# EAGLE design mini-usb-ftdi-breakout (EAGLE 7.2.0)
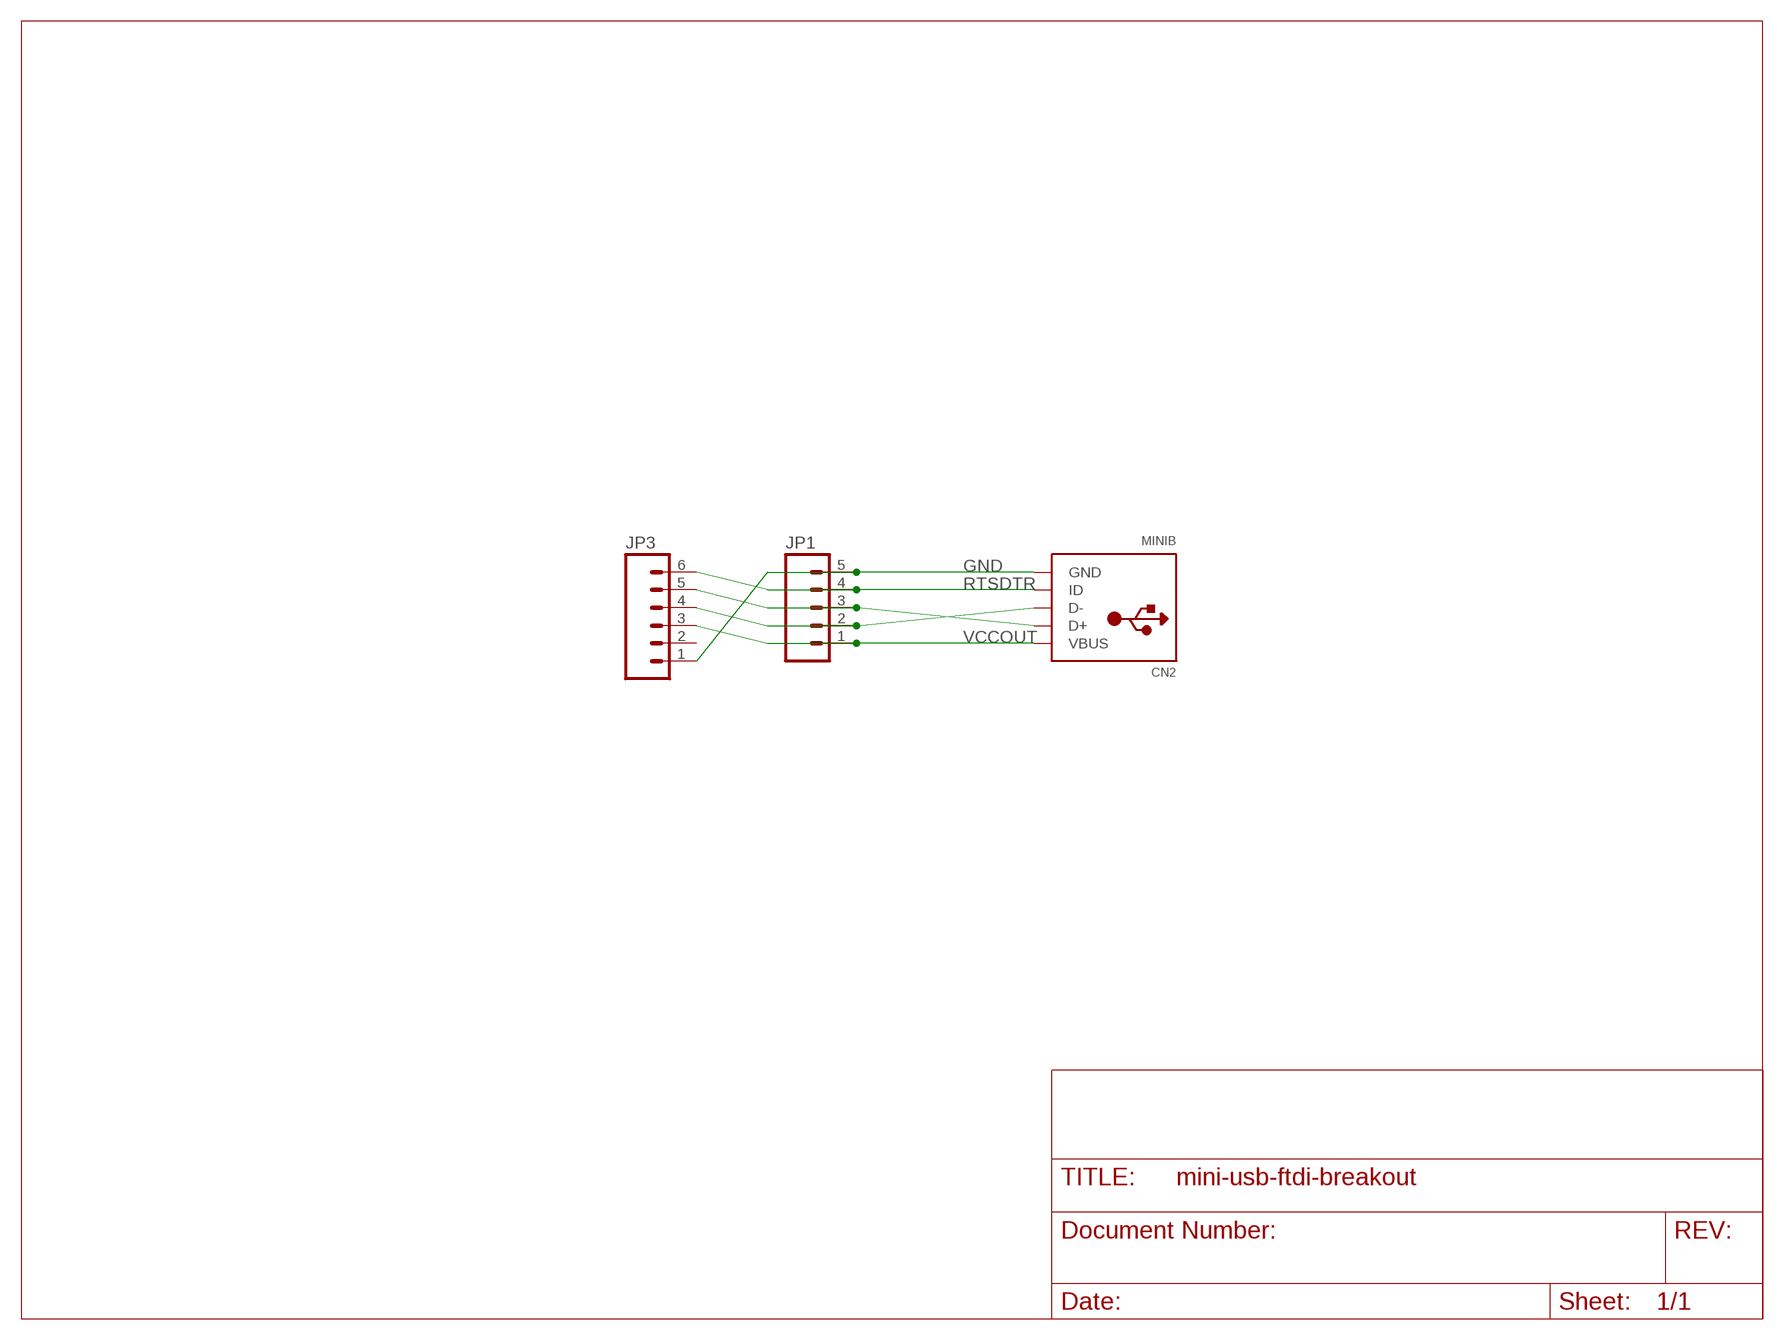
[diagram p0: schematic, sheet 1]

## Parts
CN2  MINIB  USBMINIB  [USB-MINIB]
JP1  M05PTH  [1X05]
JP3  M06SMD  [1X06-SMD]

## Nets
GND: CN2.GND JP1.5 JP3.1
N$2: CN2.D+ JP1.3 JP3.5
N$3: CN2.D- JP1.2 JP3.4
RTSDTR: CN2.ID JP1.4 JP3.6
VCCOUT: CN2.VBUS JP1.1 JP3.3
Unconnected: JP3.2

## Library data of the parts
CN2 = adafruit:USB: USB Connectors USBMINIB - Surface Mount Female Mini-B USB Connector 4UConnector: 06564 By microbuilder.eu Thru-hole RA Female Mini-B USB Connector 4UConnector: 18732 By ladyada.net
JP1 = SparkFun-Connectors:M05: Header 5 Standard 5-pin 0.1" header. Use with straight break away headers (SKU : PRT-00116), right angle break away headers (PRT-00553), swiss pins (PRT-00743), machine pins (PRT-00117), and female headers (PRT-00115). Molex polarized connector foot print use with SKU : PRT-08230 with associated crimp pins and housings.
JP3 = SparkFun-Connectors:M06: Header 6 Standard 6-pin 0.1" header. Use with straight break away headers (SKU : PRT-00116), right angle break away headers (PRT-00553), swiss pins (PRT-00743), machine pins (PRT-00117), and female headers (PRT-00115). Molex polarized connector foot print use with SKU : PRT-08094 with associated crimp pins and housings. NOTES ON THE VARIANTS LOCK and LOCK_LONGPADS... This footprint was designed to help hold the alignment of a through-hole component (i.e. 6-pin header) while soldering it into place. You may notice that each hole has been shifted either up or down by 0.005 of an inch from it's more standard position (which is a perfectly straight line). This slight alteration caused the pins (the squares in the middle) to touch the edges of the holes. Because they are alternating, it causes a "brace" to hold the component in place. 0.005 has proven to be the perfect amount of "off-center" position when using our standard breakaway headers. Although looks a little odd when you look at the bare footprint, once you have a header in there, the alteration is very hard to notice. Also,if you push a header all the way into place, it is covered up entirely on the bottom side. This idea of altering the position of holes to aid alignment will be further integrated into the Sparkfun Library for other footprints. It can help hold any component with 3 or more connection pins.

## Board
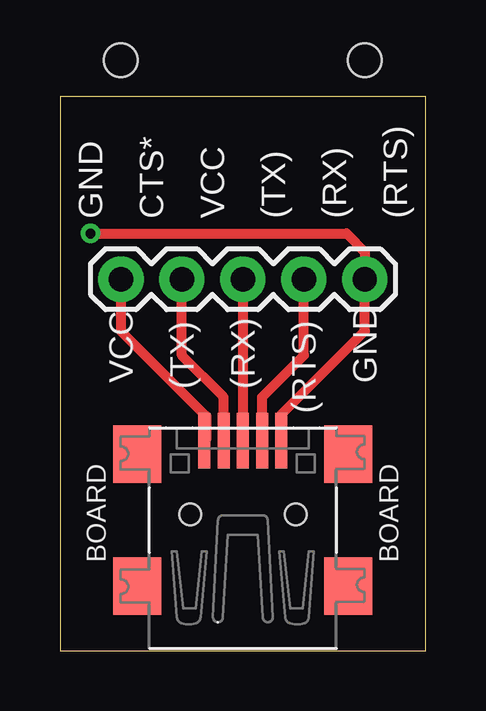
[diagram p1: board, top side]
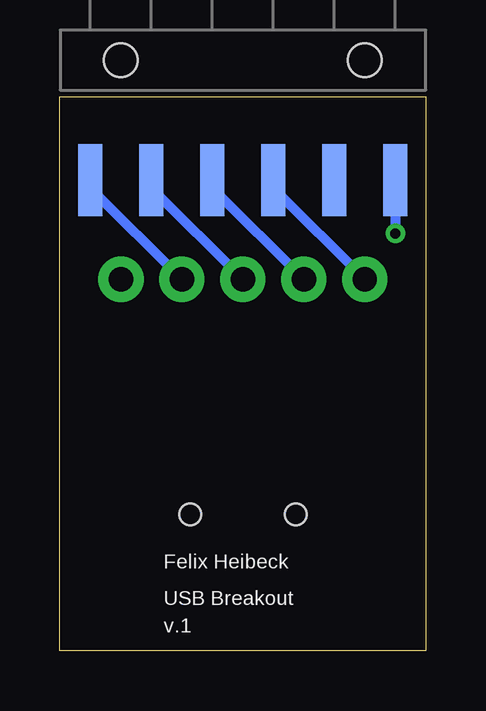
[diagram p2: board, bottom side, seen from below]

Size 15.24 x 23.11 mm. Coordinates in mm from the lower left corner, seen from the top.
Outline: 0,23.11 0,0 15.24,0 15.24,23.11 0,23.11
Copper layers (1*16): Top 0.035mm / dielectric 1.5mm / Bottom 0.035mm
Design rules "default *": minimum track width 10mil, minimum drill 19mil, track to track 8mil, track to pad 8mil, pad to pad 8mil, via to via 8mil, smd to smd 8mil, copper to edge 20mil, drill to drill 8mil, minimum pad ring 10mil, minimum via ring 8mil, stop-mask expansion 4mil, vias tented up to drill 20mil, thermal gap 10mil

### Footprints (pad centres in the part's own frame; a part is rotated, then mirrored left to right if it is on the bottom)
USB-MINIB = smd 0.5 x 2.308: D+ 0,4.064; D- -0.8,4.064; GND 1.6,4.064; ID 0.8,4.064; VBUS -1.6,4.064 | smd 2 x 2.4: GND1 -4.4,-2; GND2 -4.4,3.5; GND3 4.4,3.5; GND4 4.4,-2 | hole 0.9: -2.2,1; 2.2,1
1X05 = drill 1.016 pad 1.88: 1 0,0; 2 2.54,0; 3 5.08,0; 4 7.62,0; 5 10.16,0
1X06-SMD = smd 1 x 3: 1 -6.35,5; 2 -3.81,5; 3 -1.27,5; 4 1.27,5; 5 3.81,5; 6 6.35,5 | hole 1.4: -5.08,0; 5.08,0

### Placement (x,y rotation side)
CN2  7.62,4.7 0 top
JP1  2.54,15.49 0 top
JP3  7.62,24.64 180 bottom

### Tracks (layer width: path | path; a pad name or v marks a point on that pad's centre or on a via)
GND  (via drill 0.41)
  Top 0.406: CN2.GND 9.22,9.86 12.7,13.34 JP1.5 12.7,16.64 11.94,17.4 v1.27,17.4
  Bottom 0.406: JP3.1 v1.27,17.4
N$2
  Top 0.406: JP1.3 CN2.D+
  Bottom 0.406: JP3.5 11.43,19.3 JP1.3
N$3
  Top 0.406: CN2.D- 6.82,10.58 5.08,12.32 JP1.2
  Bottom 0.406: JP3.4 8.89,19.3 JP1.2
RTSDTR
  Top 0.406: CN2.ID 8.42,10.58 10.16,12.32 JP1.4
  Bottom 0.406: JP3.6 13.97,19.3 JP1.4
VCCOUT
  Top 0.406: JP1.1 2.54,13.34 6.1,9.78 6.1,8.84 CN2.VBUS
  Bottom 0.406: JP3.3 6.35,19.3 JP1.1

### Text on the board
tPlace: GND | CTS* | VCC | (TX) | (RX) | (RTS) | VCC | (TX) | (RX) | GND | (RTS) | BOARD | BOARD
bPlace: Felix Heibeck | USB Breakout | v.1